# Altium project PCB_Project.PrjPcb
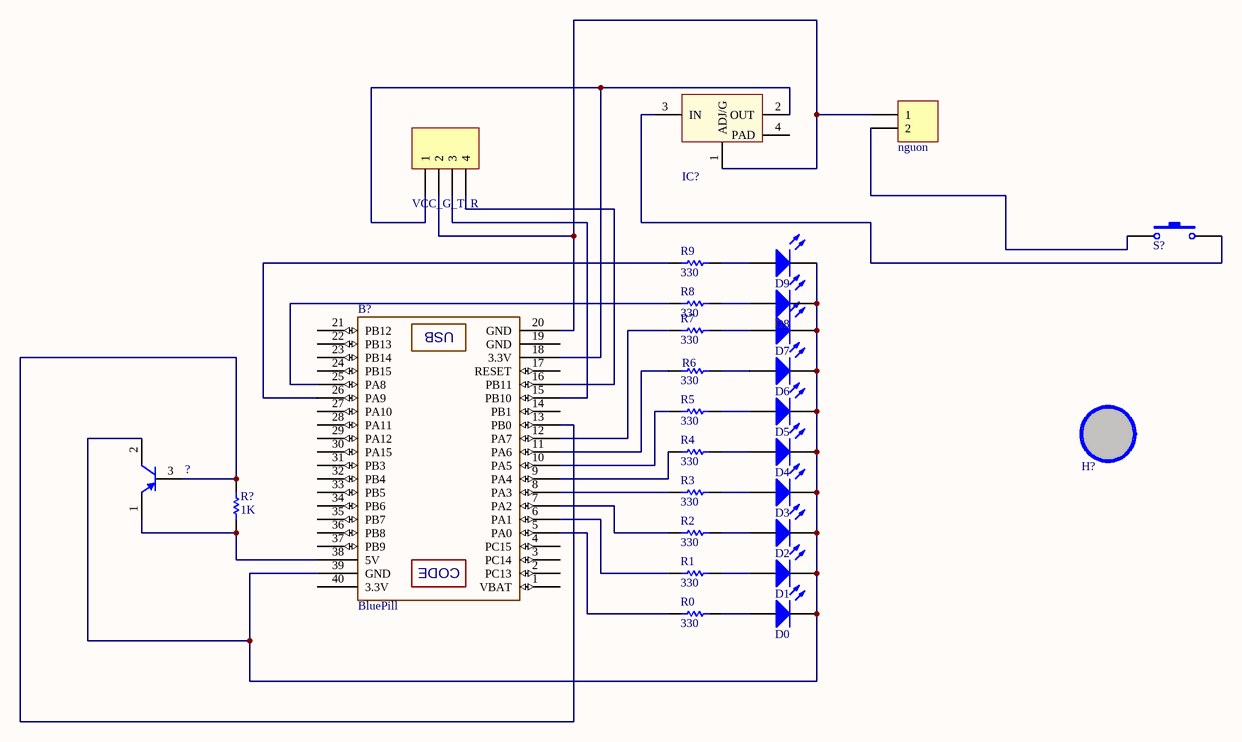
[diagram p0: Sheet1.SchDoc]
1 sheet, 28 parts. Net scope: global (net labels, ports and power ports of the same name join across sheets).
Board file: PCB1.PcbDoc

## Sheet Sheet1.SchDoc
size 381 x 241 mm

### Parts
?  A1015  [QTO-92]  (value not drawn)
B?  BluePill  [BlUEPILL]
D0  LED  [LED-3mm]  (value not drawn)
D1  LED  [LED-3mm]  (value not drawn)
D2  LED  [LED-3mm]  (value not drawn)
D3  LED  [LED-3mm]  (value not drawn)
D4  LED  [LED-3mm]  (value not drawn)
D5  LED  [LED-3mm]  (value not drawn)
D6  LED  [LED-3mm]  (value not drawn)
D7  LED  [LED-3mm]  (value not drawn)
D8  LED  [LED-3mm]  (value not drawn)
D9  LED  [LED-3mm]  (value not drawn)
H?  Hole  [LO KHOAN 3MM]  (value not drawn)
IC?  LM1117  [SOT223-4N]  (value not drawn)
nguon  Header 2  [JP2]  (value not drawn)
R0  value 330  [RES 1/2W]  (hidden comment: RESISTOR)
R1  value 330  [RES 1/2W]  (hidden comment: RESISTOR)
R2  value 330  [RES 1/2W]  (hidden comment: RESISTOR)
R3  value 330  [RES 1/2W]  (hidden comment: RESISTOR)
R4  value 330  [RES 1/2W]  (hidden comment: RESISTOR)
R5  value 330  [RES 1/2W]  (hidden comment: RESISTOR)
R6  value 330  [RES 1/2W]  (hidden comment: RESISTOR)
R7  value 330  [RES 1/2W]  (hidden comment: RESISTOR)
R8  value 330  [RES 1/2W]  (hidden comment: RESISTOR)
R9  value 330  [RES 1/2W]  (hidden comment: RESISTOR)
R?  value 1K  [RES 1/2W]  (hidden comment: RESISTOR)
S?  Tact SW - 2Pin  [SW2]  (value not drawn)
VCC_G_T_R  Header 4  [JP4]  (value not drawn)

### Nets
Net?_1: ?.1(E) B?.38(5V) R?.1
Net?_2: ?.2(C) B?.39(GND) D0.2(K) D1.2(K) D2.2(K) D3.2(K) D4.2(K) D5.2(K) D6.2(K) D7.2(K) D8.2(K) D9.2(K)
Net?_3: ?.3(B) B?.13(PB0) R?.2
NetB?_5: B?.5(PA0) R0.1
NetB?_6: B?.6(PA1) R1.1
NetB?_7: B?.7(PA2) R2.1
NetB?_8: B?.8(PA3) R3.1
NetB?_9: B?.9(PA4) R4.1
NetB?_10: B?.10(PA5) R5.1
NetB?_11: B?.11(PA6) R6.1
NetB?_12: B?.12(PA7) R7.1
NetB?_15: B?.15(PB10) VCC_G_T_R.3
NetB?_16: B?.16(PB11) VCC_G_T_R.4
NetB?_18: B?.18(3.3V) IC?.2(OUT) VCC_G_T_R.1
NetB?_20: B?.20(GND) IC?.1(ADJ/G) nguon.1 VCC_G_T_R.2
NetB?_25: B?.25(PA8) R8.1
NetB?_26: B?.26(PA9) R9.1
NetD0_1: D0.1(A) R0.2
NetD1_1: D1.1(A) R1.2
NetD2_1: D2.1(A) R2.2
NetD3_1: D3.1(A) R3.2
NetD4_1: D4.1(A) R4.2
NetD5_1: D5.1(A) R5.2
NetD6_1: D6.1(A) R6.2
NetD7_1: D7.1(A) R7.2
NetD8_1: D8.1(A) R8.2
NetD9_1: D9.1(A) R9.2
NetIC?_3: IC?.3(IN) S?.2
Netnguon_2: nguon.2 S?.1

Not connected (* = marked no-connect by the designer): B? 1(VBAT) 2(PC13) 3(PC14) 4(PC15) 14(PB1) 17(RESET) 19(GND) 21(PB12) 22(PB13) 23(PB14) 24(PB15) 27(PA10) 28(PA11) 29(PA12) 30(PA15) 31(PB3) 32(PB4) 33(PB5) 34(PB6) 35(PB7) 36(PB8) 37(PB9) 40(3.3V); H? 1; IC? 4(PAD)

### Notes on the sheet
- (in symbol BluePill) USB; CODE

### Library data of the parts
? = A1015: PNP Bipolar Transistor
H? = Hole: Hole 3mm
IC? = LM1117: Available in 1.8V, 2.5V, 2.85V, 3.3V, 5V, and  Adjustable Versions; Value: LM317
nguon = Header 2: Header, 2-Pin; LatestRevisionDate: 17-Jul-2002; LatestRevisionNote: Re-released for DXP Platform.; Publisher: Altium Limited
S? = Tact SW - 2Pin: Switch button 2 pin
VCC_G_T_R = Header 4: Header, 4-Pin; LatestRevisionDate: 17-Jul-2002; LatestRevisionNote: Re-released for DXP Platform.; Publisher: Altium Limited